# Altium schematic sheet 锂电池充电器原理图.SchDoc
size A4
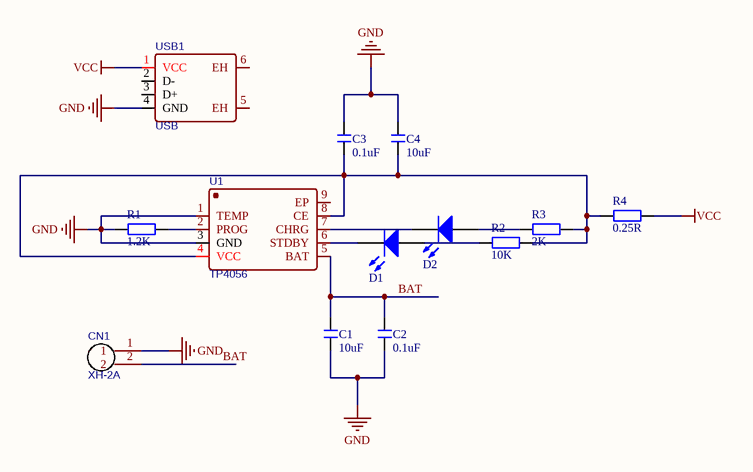
[diagram p0: 锂电池充电器原理图.SchDoc]

## Parts
C1  10uF  [0805C]
C2  0.1uF  [0805C]
C3  0.1uF  [0805C]
C4  10uF  [0805C]
CN1  XH-2A  [XH-2P]
D1  LED  [LED 0805B]  (value not drawn)
D2  LED  [LED 0805B]  (value not drawn)
R1  1.2K  [0805R]
R2  10K  [0805R]
R3  2K  [0805R]
R4  0.25R  [0805R]
U1  TP4056  [ESOP8]
USB1  USB  [USB_A 插头]

## Nets
GND: C1.1 C2.1 C3.1 C4.1 CN1.1 R1.1 U1.1(TEMP) U1.3(GND) USB1.4(GND)
VCC: R4.2 USB1.1(VCC)
BAT: C1.2 C2.2 CN1.2 U1.5(BAT)
NetC3_2: C3.2 C4.2 R2.2 R3.2 R4.1 U1.4(VCC) U1.8(CE)
NetD1_1: D1.1(A) R2.1
NetD1_2: D1.2(K) U1.6(STDBY)
NetD2_1: D2.1(A) R3.1
NetD2_2: D2.2(K) U1.7(CHRG)
NetR1_2: R1.2 U1.2(PROG)

Not connected (* = marked no-connect by the designer): U1 9(EP); USB1 2(D-) 3(D+) 5(EH) 6(EH)

## Library data of the parts
C1-C4 = C: 贴片电容; BOM名称: 无极性贴片电容; 淘宝ID: 封装库来自淘宝 ID：黄晶宝石; 联系售后: https://shop463601444.taobao.com
CN1 = XH-2A: 插接件; BOM_Manufacturer: BOOMELE; BOM_Supplier: LCSC; BOM_Manufacturer Part: XH-2A; BOM_Supplier Part: C20079; BOM_JLCPCB Part Class: Extended Part; spicePre: C; spiceSymbolName: XH-2A
D1 D2 = LED: 发光二极管; Published: 8-Jun-2000; LatestRevisionDate: 08-Jul-2005; LatestRevisionNote: Mech Layer 1 removed.; PackageReference: LED-0; Publisher: Altium Limited
R1-R4 = R: 贴片电阻; 版权归属: 来自淘宝 ID：黄晶宝石; BOM名称: 贴片电阻; 联系售后: https://shop463601444.taobao.com
U1 = TP4056: 充电芯片 ESOP8; BOM_Manufacturer: UMW(Youtai Semiconductor Co., Ltd.); Contributor: LCSC; BOM_Supplier: LCSC; BOM_Supplier Part: C725790; BOM_Manufacturer Part: TP4056; BOM_JLCPCB Part Class: Extended Part; spicePre: U; spiceSymbolName: TP4056_C725790
USB1 = USB: USB_Type-A 插头; BOM_Manufacturer: SOFNG; BOM_Manufacturer Part: USB-05; Contributor: LCSC; BOM_Supplier: LCSC; BOM_Supplier Part: C112454; BOM_JLCPCB Part Class: Extended Part; spicePre: U; spiceSymbolName: USB-05